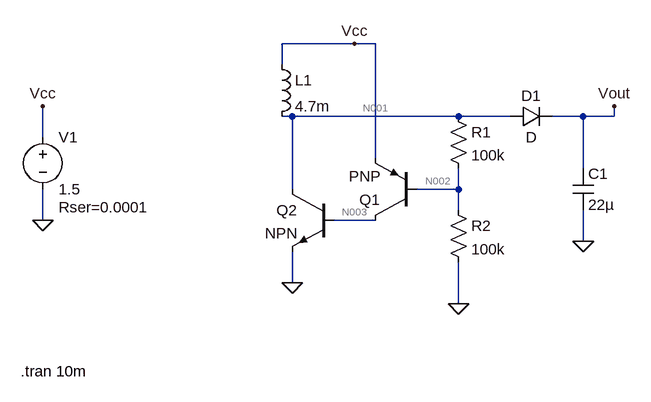
[diagram p0: schematic joule_thief_V2.asc]
joule_thief_V2.asc, the LTspice schematic file:
Version 4
SHEET 1 880 680
WIRE 240 -16 128 -16
WIRE 272 -16 240 -16
WIRE 128 16 128 -16
WIRE 144 96 128 96
WIRE 400 96 144 96
WIRE 480 96 400 96
WIRE 592 96 544 96
WIRE 640 96 640 80
WIRE 640 96 592 96
WIRE -240 128 -240 80
WIRE 272 160 272 -16
WIRE 592 176 592 96
WIRE 144 208 144 96
WIRE 400 208 400 176
WIRE 400 208 336 208
WIRE 400 240 400 208
WIRE -240 256 -240 208
WIRE 272 256 208 256
WIRE 592 288 592 240
WIRE 144 352 144 304
WIRE 400 384 400 320
FLAG -240 256 0
FLAG -240 80 Vcc
FLAG 400 384 0
FLAG 240 -16 Vcc
FLAG 144 352 0
FLAG 640 80 Vout
FLAG 592 288 0
SYMBOL voltage -240 112 R0
WINDOW 123 0 0 Left 0
WINDOW 39 24 124 Left 2
SYMATTR InstName V1
SYMATTR Value 1.5
SYMATTR SpiceLine Rser=0.0001
SYMBOL ind 112 0 R0
SYMATTR InstName L1
SYMATTR Value 4.7m
SYMBOL res 384 80 R0
SYMATTR InstName R1
SYMATTR Value 100k
SYMBOL res 384 224 R0
SYMATTR InstName R2
SYMATTR Value 100k
SYMBOL npn 208 208 M0
SYMATTR InstName Q2
SYMBOL pnp 336 256 R180
SYMATTR InstName Q1
SYMBOL diode 480 112 R270
WINDOW 0 32 32 VTop 2
WINDOW 3 0 32 VBottom 2
SYMATTR InstName D1
SYMBOL cap 576 176 R0
SYMATTR InstName C1
SYMATTR Value 22µ
TEXT -274 488 Left 2 !.tran 10m

The netlist it stands for:
* joule_thief_V2.asc
V1 Vcc 0 1.5 Rser=0.0001
L1 Vcc N001 4.7m
R1 N001 N002 100k
R2 N002 0 100k
Q2 N001 N003 0 0 NPN
Q1 N003 N002 Vcc 0 PNP
D1 N001 Vout D
C1 Vout 0 22µ
.model D D
.lib standard.dio
.model NPN NPN
.model PNP PNP
.lib standard.bjt
.tran 10m
.backanno
.end

* Results of the author's LTspice run, read from the files saved beside the schematic
* Operating Point, zero values left out:
*   V(vcc) = 1.5 V
*   V(n001) = 1.5 V
*   V(n002) = 790.7 mV
*   V(n003) = 828.4 mV
*   V(vout) = 1.5 V
*   Ic(Q1) = -81.34 µA
*   Ib(Q1) = -813.4 nA
*   Ie(Q1) = 82.15 µA
*   Ic(Q2) = 8.134 mA
*   Ib(Q2) = 81.34 µA
*   Ie(Q2) = -8.215 mA
*   I(L1) = 8.141 mA
*   I(R2) = 7.907 µA
*   I(R1) = 7.093 µA
*   I(V1) = -8.223 mA